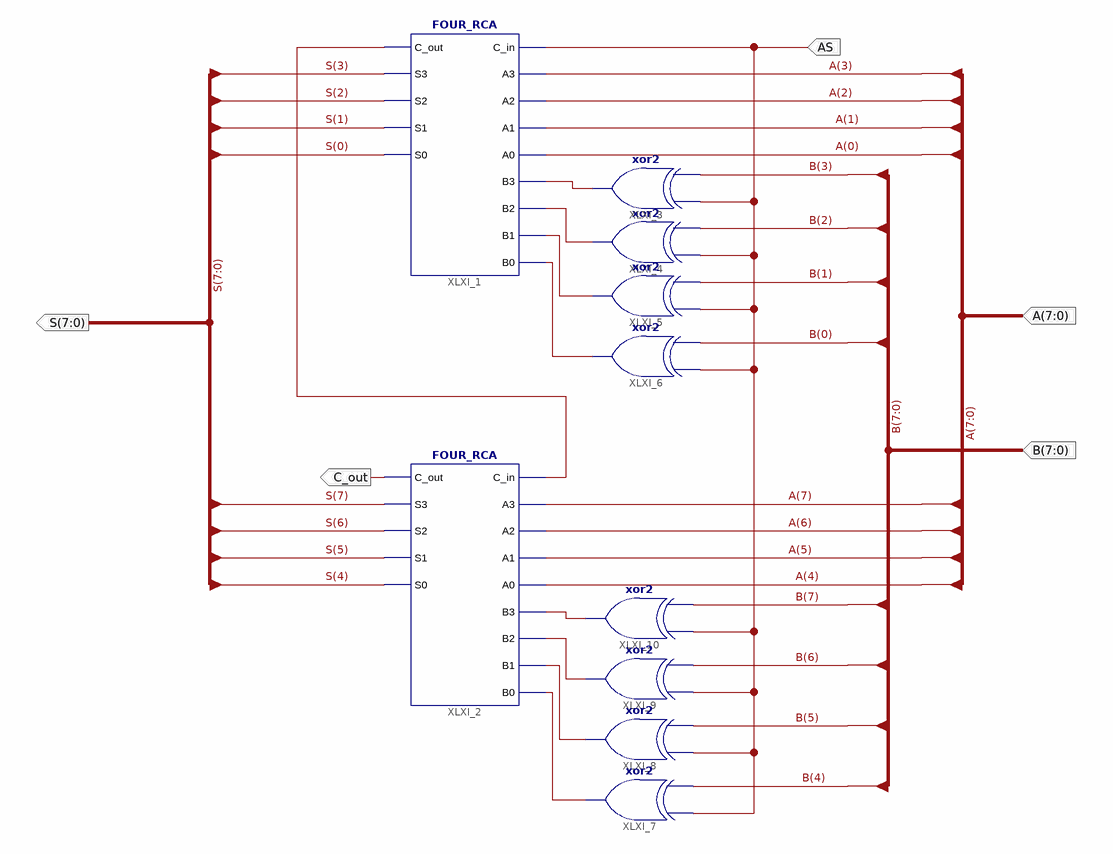
[diagram p0: schematic sheet 1]
// Xilinx ISE schematic Add_Sub.sch (spartan3e) as structural Verilog: 10 symbols, 5 ports
module Add_Sub (
  input  AS,
  input  [7:0] A,
  input  [7:0] B,
  output [7:0] S,
  output C_out
);

  wire XLXN_10, XLXN_13, XLXN_14, XLXN_15, XLXN_55, XLXN_60, XLXN_61, XLXN_62, XLXN_63;

  FOUR_RCA XLXI_1 (
    .A0(A[0]), .A1(A[1]), .A2(A[2]), .A3(A[3]), .B0(XLXN_15), .B1(XLXN_14), .B2(XLXN_13), .B3(XLXN_10),
    .C_in(AS), .C_out(XLXN_55), .S0(S[0]), .S1(S[1]), .S2(S[2]), .S3(S[3]));
  FOUR_RCA XLXI_2 (
    .A0(A[4]), .A1(A[5]), .A2(A[6]), .A3(A[7]), .B0(XLXN_63), .B1(XLXN_62), .B2(XLXN_61), .B3(XLXN_60),
    .C_in(XLXN_55), .C_out(C_out), .S0(S[4]), .S1(S[5]), .S2(S[6]), .S3(S[7]));
  xor XLXI_10 (XLXN_60, B[7], AS);
  xor XLXI_3 (XLXN_10, B[3], AS);
  xor XLXI_4 (XLXN_13, B[2], AS);
  xor XLXI_5 (XLXN_14, B[1], AS);
  xor XLXI_6 (XLXN_15, B[0], AS);
  xor XLXI_7 (XLXN_63, B[4], AS);
  xor XLXI_8 (XLXN_62, B[5], AS);
  xor XLXI_9 (XLXN_61, B[6], AS);
endmodule
